# EAGLE design tinyha_power (EAGLE 7.5.0)
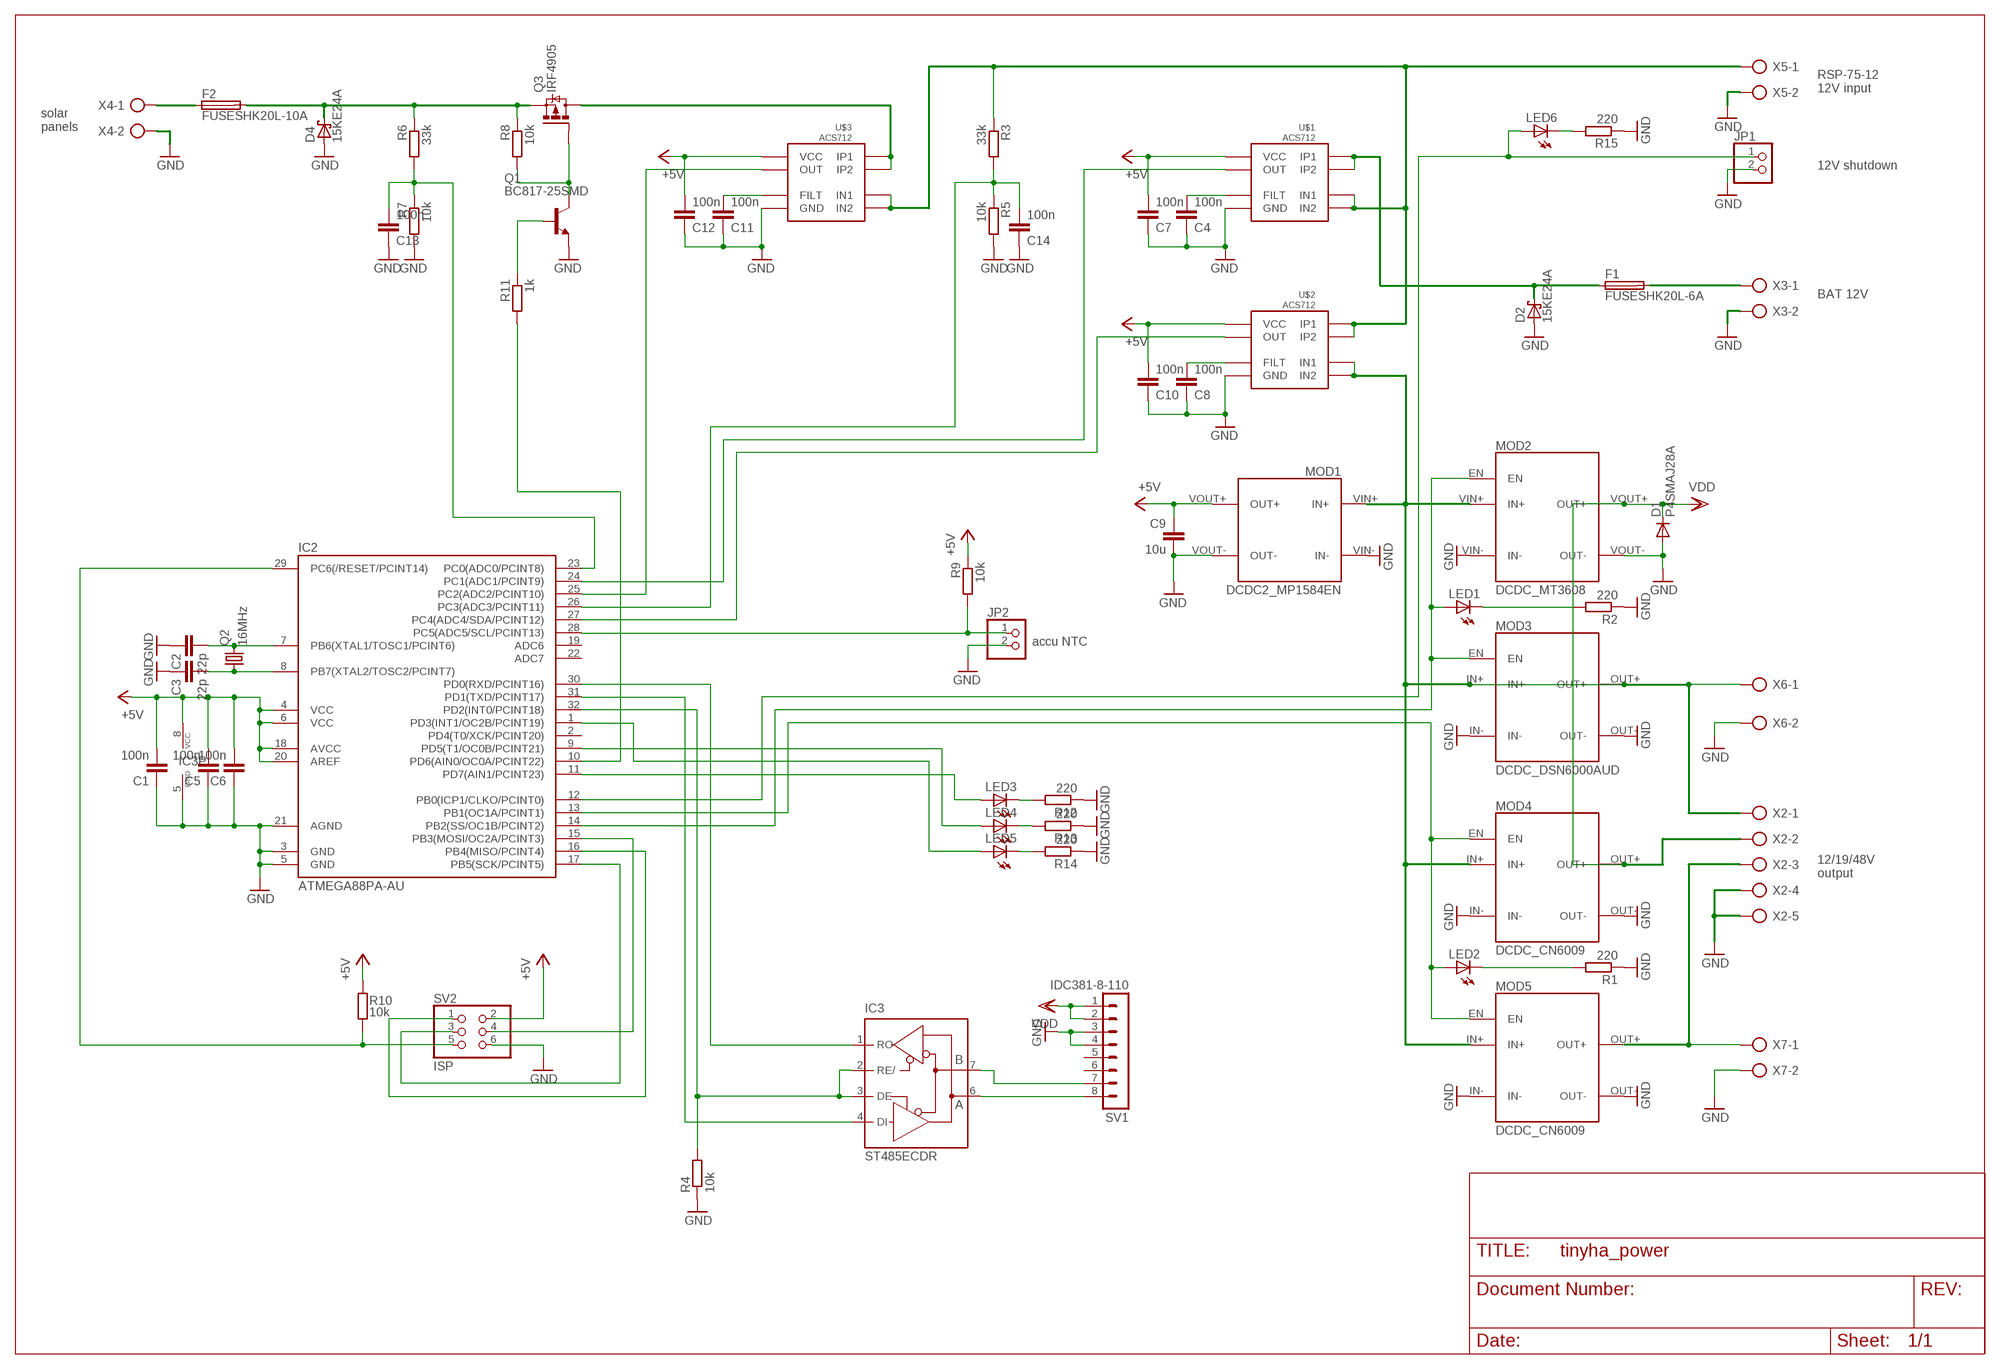
[diagram p0: schematic, sheet 1]

## Parts
C1  100n  C-EUC0805K  [C0805K]
C2  22p  C-EUC0805K  [C0805K]
C3  22p  C-EUC0805K  [C0805K]
C4  100n  C-EUC0805  [C0805]
C5  100n  C-EUC0805K  [C0805K]
C6  100n  C-EUC0805K  [C0805K]
C7  100n  C-EUC0805  [C0805]
C8  100n  C-EUC0805  [C0805]
C9  10u  C-EUC0805K  [C0805K]
C10  100n  C-EUC0805  [C0805]
C11  100n  C-EUC0805  [C0805]
C12  100n  C-EUC0805  [C0805]
C13  100n  C-EUC0805  [C0805]
C14  100n  C-EUC0805  [C0805]
D1  P4SMAJ28A  DIODE-DO214AC  [DO214AC]
D2  15KE24A  15KEXX  [CB429-17]
D4  15KE24A  15KEXX  [CB429-17]
F1  FUSESHK20L-6A  FUSESHK20L  [SHK20L]
F2  FUSESHK20L-10A  FUSESHK20L  [SHK20L]
IC2  ATMEGA88PA-AU  ATMEGA48/88/168-AU  [TQFP32-08]
IC3  ST485ECDR  MAX481CSA  [SO08]
JP1  PINHD-1X2  [1X02]
JP2  PINHD-1X2  [1X02]
LED1  LED3MM  [LED3MM]
LED2  LED3MM  [LED3MM]
LED3  LED3MM  [LED3MM]
LED4  LED3MM  [LED3MM]
LED5  LED3MM  [LED3MM]
LED6  LED3MM  [LED3MM]
MOD1  DCDC2_MP1584EN  [DCDC_MP1584EN]
MOD2  DCDC_MT3608  [DCDC_MT3608]
MOD3  DCDC_DSN6000AUD  [DCDC_DSN6000AUD]
MOD4  DCDC_CN6009  [DCDC_CN6009]
MOD5  DCDC_CN6009  [DCDC_CN6009]
Q1  BC817-25SMD  [SOT23-BEC]
Q2  16MHz  CRYSTALHC49S  [HC49/S]
Q3  IRF4905  [TO220BH]
R1  220  R-EU_R0805  [R0805]
R2  220  R-EU_R0805  [R0805]
R3  33k  R-EU_R0805  [R0805]
R4  10k  R-EU_R0805  [R0805]
R5  10k  R-EU_R0805  [R0805]
R6  33k  R-EU_R0805  [R0805]
R7  10k  R-EU_R0805  [R0805]
R8  10k  R-EU_R0805  [R0805]
R9  10k  R-EU_R0805  [R0805]
R10  10k  R-EU_R0805  [R0805]
R11  1k  R-EU_R0805  [R0805]
R12  220  R-EU_R0805  [R0805]
R13  220  R-EU_R0805  [R0805]
R14  220  R-EU_R0805  [R0805]
R15  220  R-EU_R0805  [R0805]
SV1  IDC381-8-110  MA08-1-IDC  [IDC381-8]
SV2  ISP  PINHD-2X3/H  [2X03/H]
U$1  ACS712  [SO8]
U$2  ACS712  [SO8]
U$3  ACS712  [SO8]
X2  AK500/5  [AK500/5]
X3  AK500/2  [AK500/2]
X4  AK500/2  [AK500/2]
X5  AK500/2  [AK500/2]
X6  AK500/2  [AK500/2]
X7  AK500/2  [AK500/2]

## Nets
+5V: C1.2 C5.2 C6.2 C7.2 C9.1 C10.2 C12.2 IC2.4(VCC) IC2.6(VCC) IC2.18(AVCC) IC2.20(AREF) IC3.8(VCC) MOD1.VOUT+(OUT+) R9.1 R10.1 SV2.2 U$1.8(VCC) U$2.8(VCC) U$3.8(VCC)
DIR: IC2.32(PD2(INT0/PCINT18)) IC3.2(RE/) IC3.3(DE) R4.2
GND: C1.1 C2.1 C3.1 C4.1 C5.1 C6.1 C7.1 C8.1 C9.2 C10.1 C11.1 C12.1 C13.1 C14.1 D1.A D2.A D4.A IC2.3(GND) IC2.5(GND) IC2.21(AGND) IC3.5(GND) JP1.2 JP2.2 MOD1.VIN-(IN-) MOD1.VOUT-(OUT-) MOD2.VIN-(IN-) MOD2.VOUT-(OUT-) MOD3.IN- MOD3.OUT- MOD4.IN- MOD4.OUT- MOD5.IN- MOD5.OUT- Q1.E R1.1 R2.1 R4.1 R5.2 R7.2 R12.1 R13.1 R14.1 R15.1 SV1.3 SV1.4 SV2.6 U$1.5(GND) U$2.5(GND) U$3.5(GND) X2.4 X2.5 X3.2 X4.2 X5.2 X6.2 X7.2
MOSI: IC2.15(PB3(MOSI/OC2A/PCINT3)) SV2.4
N$1: D4.C F2.2A Q3.S R6.1 R8.1
N$2: IC2.13(PB1(OC1A/PCINT1)) LED2.A MOD4.EN MOD5.EN
N$3: IC2.14(PB2(SS/OC1B/PCINT2)) LED1.A MOD2.EN MOD3.EN
N$4: LED2.K(C) R1.2
N$5: LED1.K(C) R2.2
N$6: IC2.11(PD7(AIN1/PCINT23)) LED3.A
N$7: C4.2 U$1.6(FILT)
N$8: D2.C F1.1A U$1.1(IP1) U$1.2(IP2)
N$9: IC2.9(PD5(T1/OC0B/PCINT21)) LED4.A
N$10: IC3.7(B) SV1.7
N$11: LED6.K(C) R15.2
N$12: C8.2 U$2.6(FILT)
N$15: IC3.6(A) SV1.8
N$16: MOD5.OUT+ X2.3 X7.1
N$17: F1.2A X3.1
N$18: IC2.1(PD3(INT1/OC2B/PCINT19)) LED5.A
N$19: IC2.28(PC5(ADC5/SCL/PCINT13)) JP2.1 R9.2
N$21: MOD1.VIN+(IN+) MOD2.VIN+(IN+) MOD3.IN+ MOD3.OUT+ MOD4.IN+ MOD5.IN+ U$2.3(IN1) U$2.4(IN2) X2.1 X6.1
N$22: C11.2 U$3.6(FILT)
N$24: C3.2 IC2.8(PB7(XTAL2/TOSC2/PCINT7)) Q2.1
N$25: Q1.C Q3.G R8.2
N$26: C14.2 IC2.26(PC3(ADC3/PCINT11)) R3.2 R5.1
N$27: IC2.24(PC1(ADC1/PCINT9)) U$1.7(OUT)
N$28: IC2.27(PC4(ADC4/SDA/PCINT12)) U$2.7(OUT)
N$29: F2.1A X4.1
N$30: R3.1 U$1.3(IN1) U$1.4(IN2) U$2.1(IP1) U$2.2(IP2) U$3.3(IN1) U$3.4(IN2) X5.1
N$31: C2.2 IC2.7(PB6(XTAL1/TOSC1/PCINT6)) Q2.2
N$32: Q3.D U$3.1(IP1) U$3.2(IP2)
N$33: IC2.25(PC2(ADC2/PCINT10)) U$3.7(OUT)
N$34: C13.2 IC2.23(PC0(ADC0/PCINT8)) R6.2 R7.1
N$35: Q1.B R11.1
N$36: IC2.10(PD6(AIN0/OC0A/PCINT22)) R11.2
N$37: LED3.K(C) R12.2
N$38: LED4.K(C) R13.2
N$39: LED5.K(C) R14.2
N$40: IC2.12(PB0(ICP1/CLKO/PCINT0)) JP1.1 LED6.A
RESET: IC2.29(PC6(/RESET/PCINT14)) R10.2 SV2.5
RXD: IC2.30(PD0(RXD/PCINT16)) IC3.1(RO)
SCK: IC2.17(PB5(SCK/PCINT5)) SV2.3
TXD: IC2.31(PD1(TXD/PCINT17)) IC3.4(DI)
UH: IC2.16(PB4(MISO/PCINT4)) SV2.1
VDD: D1.C MOD2.VOUT+(OUT+) MOD4.OUT+ SV1.1 SV1.2 X2.2
Unconnected: IC2.2(PD4(T0/XCK/PCINT20)) IC2.19(ADC6) IC2.22(ADC7) SV1.5 SV1.6

## Notes on the sheet
- RSP-75-12
  12V input
- solar
  panels
- 12V shutdown
- BAT 12V
- accu NTC
- 12/19/48V
  output

## Library data of the parts
C1-C14 = rcl:C-EU: CAPACITOR, European symbol
D1 = diode:DIODE-: DIODE
D2 D4 = diode:15KEXX: DIODE
F1 F2 = fuse:FUSE: Fuse; OC_FARNELL: unknown; OC_NEWARK: unknown
IC2 = atmega8:ATMEGA48/88/168
IC3 = maxim:MAX481CSA: RS485 TRANSEIVER; MF: MAXIM; MPN: MAX481CSA; OC_FARNELL: unknown; OC_NEWARK: 90C3817
JP1 JP2 = pinhead:PINHD-1X2: PIN HEADER
LED1-LED6 = led:LED: LED OSRAM: - CHIPLED LG R971, LG N971, LY N971, LG Q971, LY Q971, LO R971, LY R971 LH N974, LH R974 LS Q976, LO Q976, LY Q976 LO Q996 - Hyper CHIPLED LW Q18S LB Q993, LB Q99A, LB R99A - SideLED LS A670, LO A670, LY A670, LG A670, LP A670 LB A673, LV A673, LT A673, LW A673 LH A674 LY A675 LS A676, LA A676, LO A676, LY A676, LW A676 LS A679, LY A679, LG A679 - Hyper Micro SIDELED® LS Y876, LA Y876, LO Y876, LY Y876 LT Y87S - SmartLED LW L88C, LW L88S LB L89C, LB L89S, LG L890 LS L89K, LO L89K, LY L89K LS L896, LA L896, LO L896, LY L896 - TOPLED LS T670, LO T670, LY T670, LG T670, LP T670 LSG T670, LSP T670, LSY T670, LOP T670, LYG T670 LG T671, LOG T671, LSG T671 LB T673, LV T673, LT T673, LW T673 LH T674 LS T676, LA T676, LO T676, LY T676, LB T676, LH T676, LSB T676, LW T676 LB T67C, LV T67C, LT T67C, LS T67K, LO T67K, LY T67K, LW E67C LS E67B, LA E67B, LO E67B, LY E67B, LB E67C, LV E67C, LT E67C LW T67C LS T679, LY T679, LG T679 LS T770, LO T770, LY T770, LG T770, LP T770 LB T773, LV T773, LT T773, LW T773 LH T774 LS E675, LA E675, LY E675, LS T675 LS T776, LA T776, LO T776, LY T776, LB T776 LHGB T686 LT T68C, LB T68C - Hyper Mini TOPLED® LB M676 - Mini TOPLED Santana® LG M470 LS M47K, LO M47K, LY M47K Source: http://www.osram.convergy.de LUXEON: - LUMILED® LXK2-PW12-R00, LXK2-PW12-S00, LXK2-PW14-U00, LXK2-PW14-V00 LXK2-PM12-R00, LXK2-PM12-S00, LXK2-PM14-U00 LXK2-PE12-Q00, LXK2-PE12-R00, LXK2-PE12-S00, LXK2-PE14-T00, LXK2-PE14-U00 LXK2-PB12-K00, LXK2-PB12-L00, LXK2-PB12-M00, LXK2-PB14-N00, LXK2-PB14-P00, LXK2-PB14-Q00 LXK2-PR12-L00, LXK2-PR12-M00, LXK2-PR14-Q00, LXK2-PR14-R00 LXK2-PD12-Q00, LXK2-PD12-R00, LXK2-PD12-S00 LXK2-PH12-R00, LXK2-PH12-S00 LXK2-PL12-P00, LXK2-PL12-Q00, LXK2-PL12-R00 Source: www.luxeon.com KINGBRIGHT: KA-3528ASYC Source: www.kingbright.com
MOD1 = custom:DCDC2
MOD2-MOD5 = custom:DCDC
Q1 = transistor-npn:BC817*: NPN Transistor
Q2 = crystal:CRYSTAL: CRYSTAL; OC_FARNELL: 1667008; OC_NEWARK: unknown
Q3 = transistor-power:IRF4905: P-Channel HEXFET® Power MOSFET RDS(on)= 0.02 Ohm, ID = -74A Source: http://www.irf.com/product-info/datasheets/data/irf4905pbf.pdf
R1-R15 = rcl:R-EU_: RESISTOR, European symbol
SV1 = custom:MA08-1: PIN HEADER
SV2 = pinhead:PINHD-2X3: PIN HEADER
U$1-U$3 = allegro:ACS712
X2 = con-ptr500:AK500/5: CONNECTOR; OC_FARNELL: unknown; OC_NEWARK: unknown
X3-X7 = con-ptr500:AK500/2: CONNECTOR; OC_FARNELL: unknown; OC_NEWARK: unknown

## Board
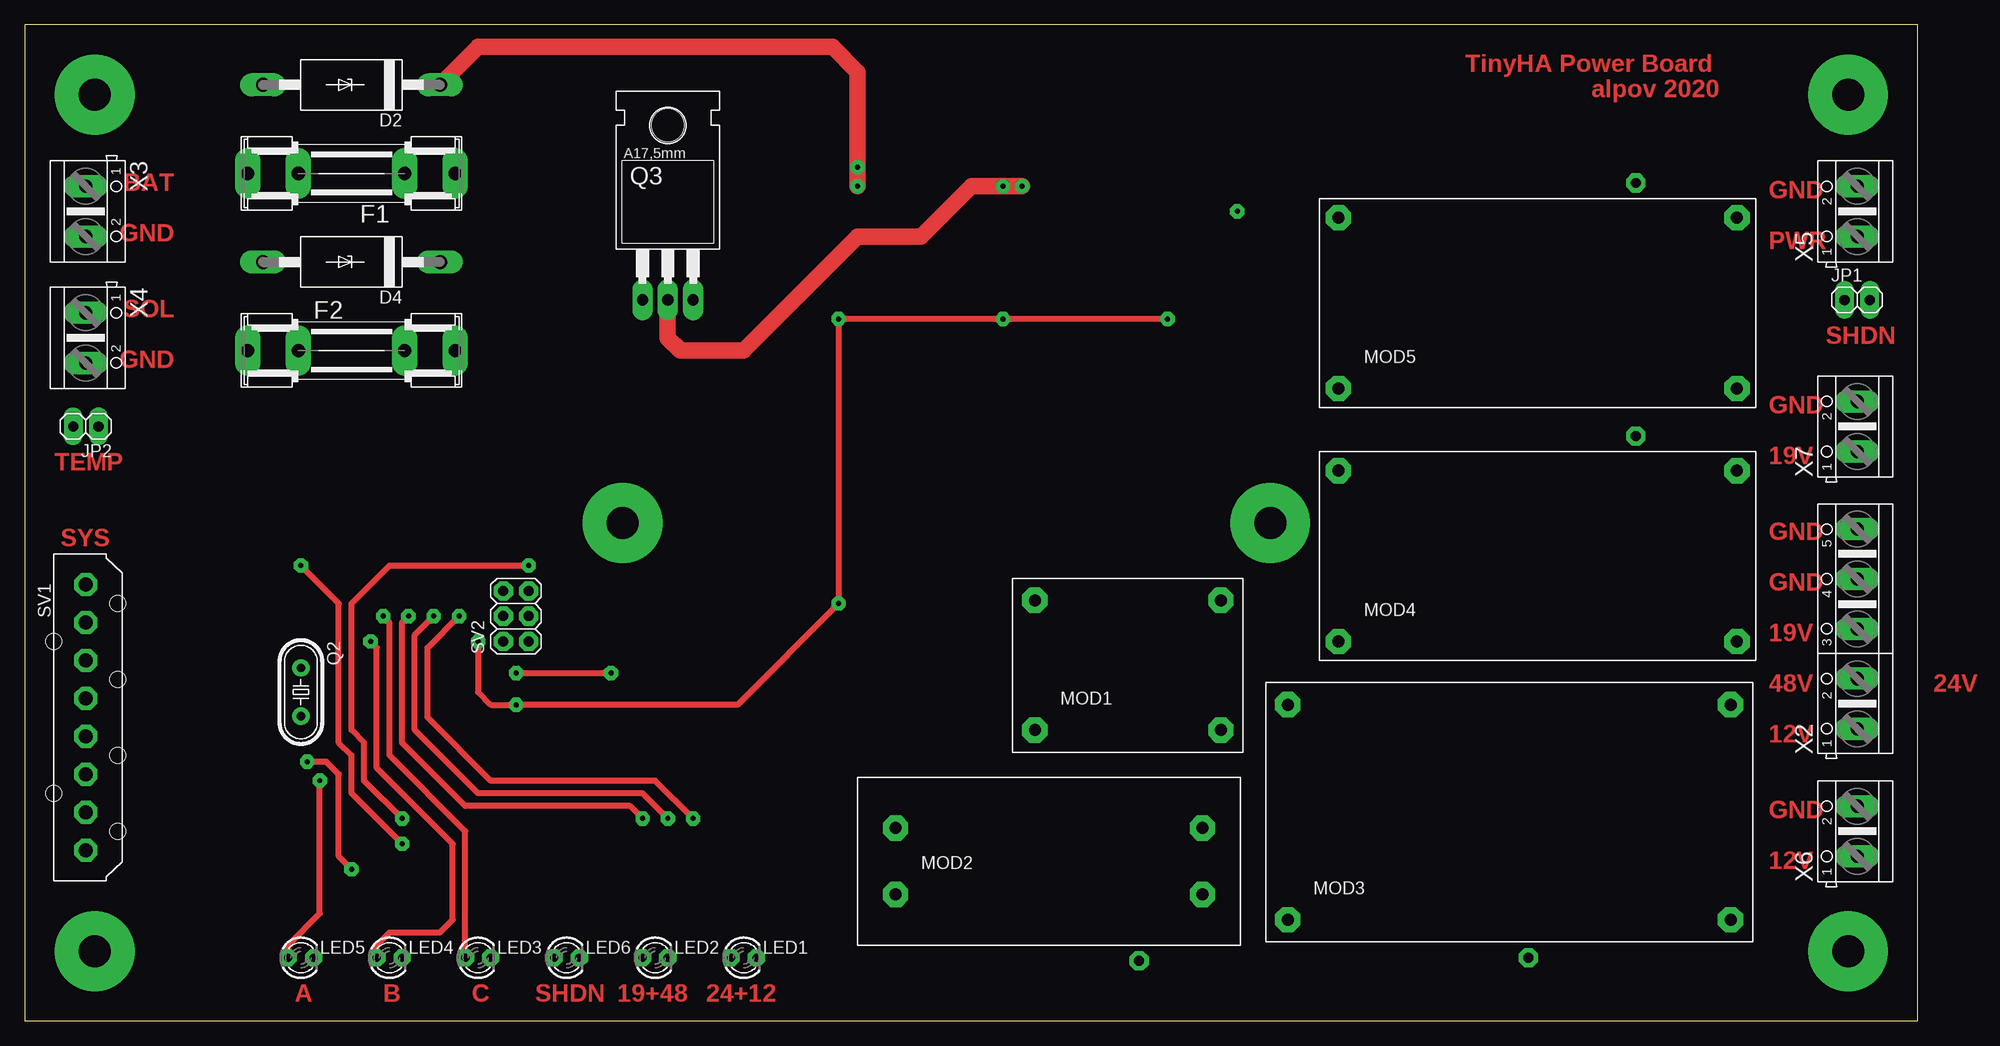
[diagram p1: board, top side]
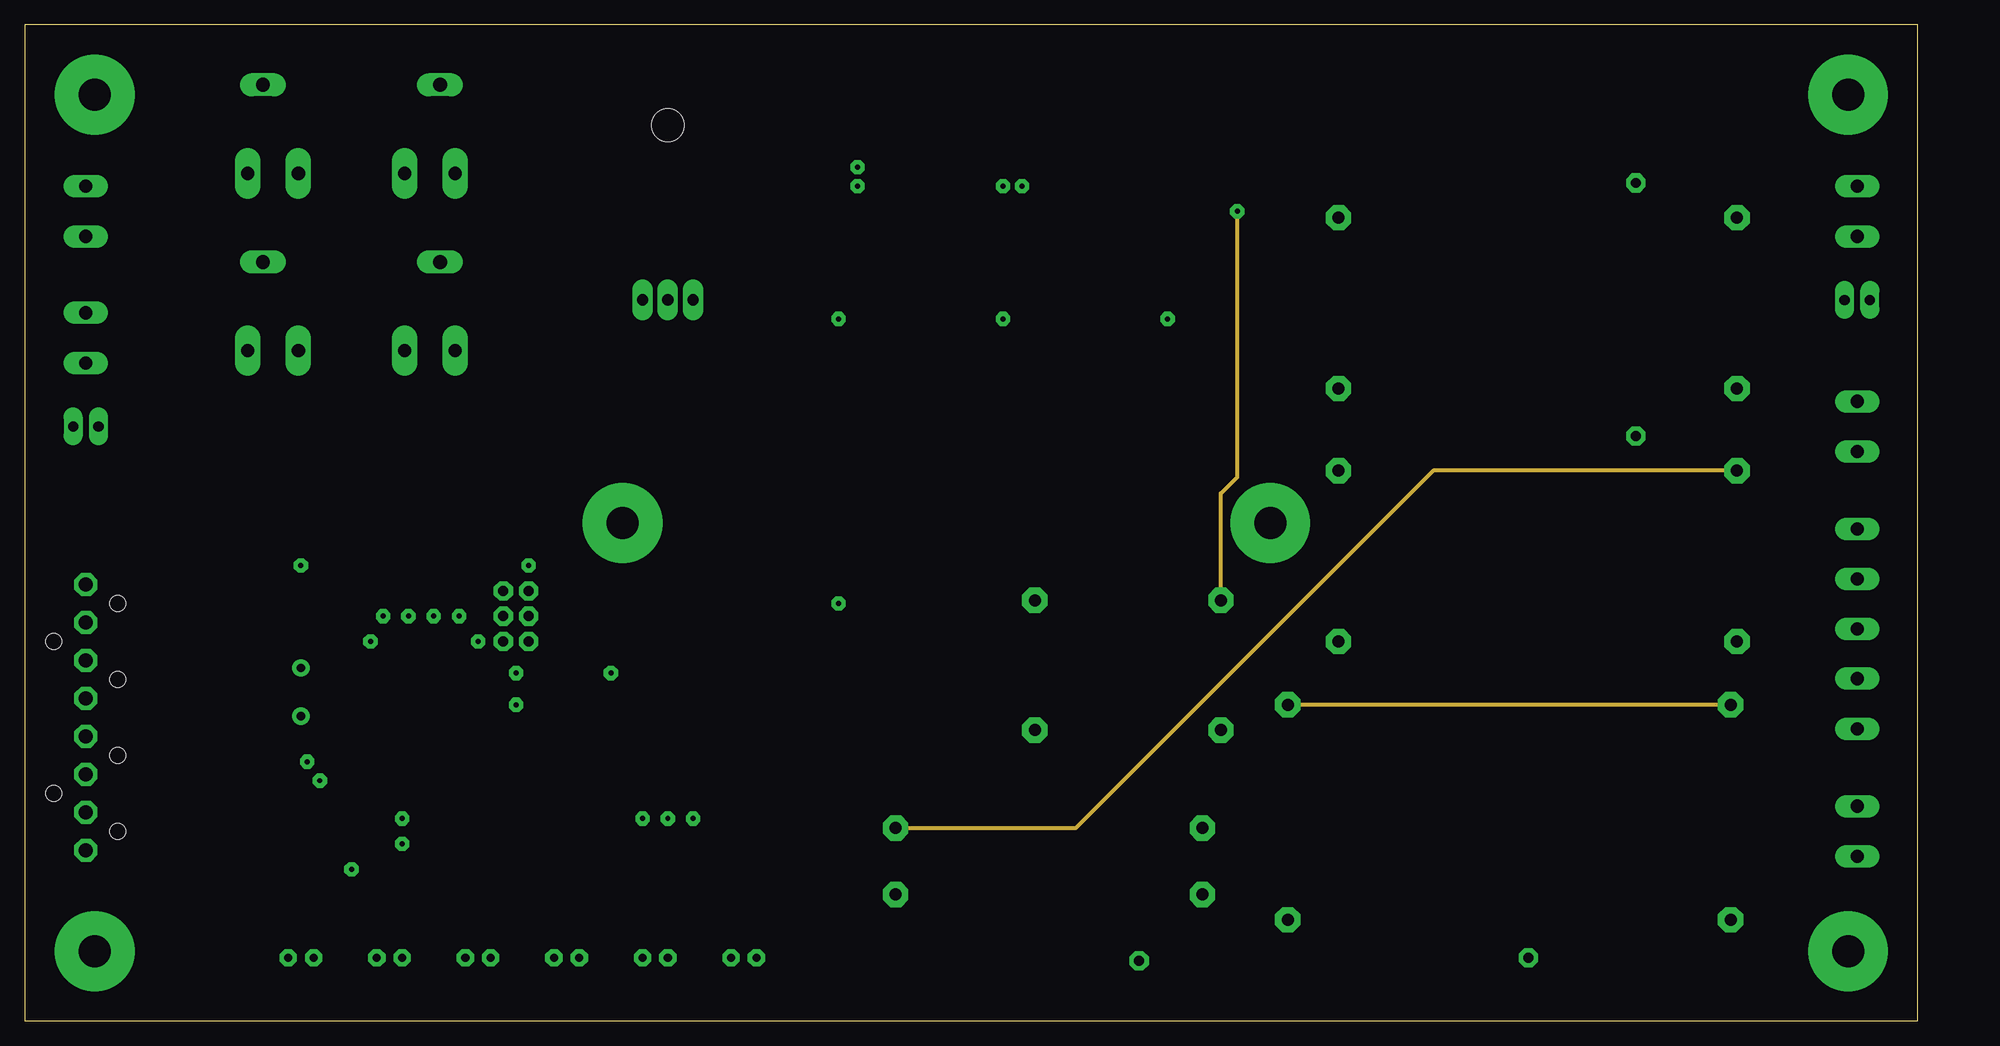
[diagram p2: board, inner layer Route2]
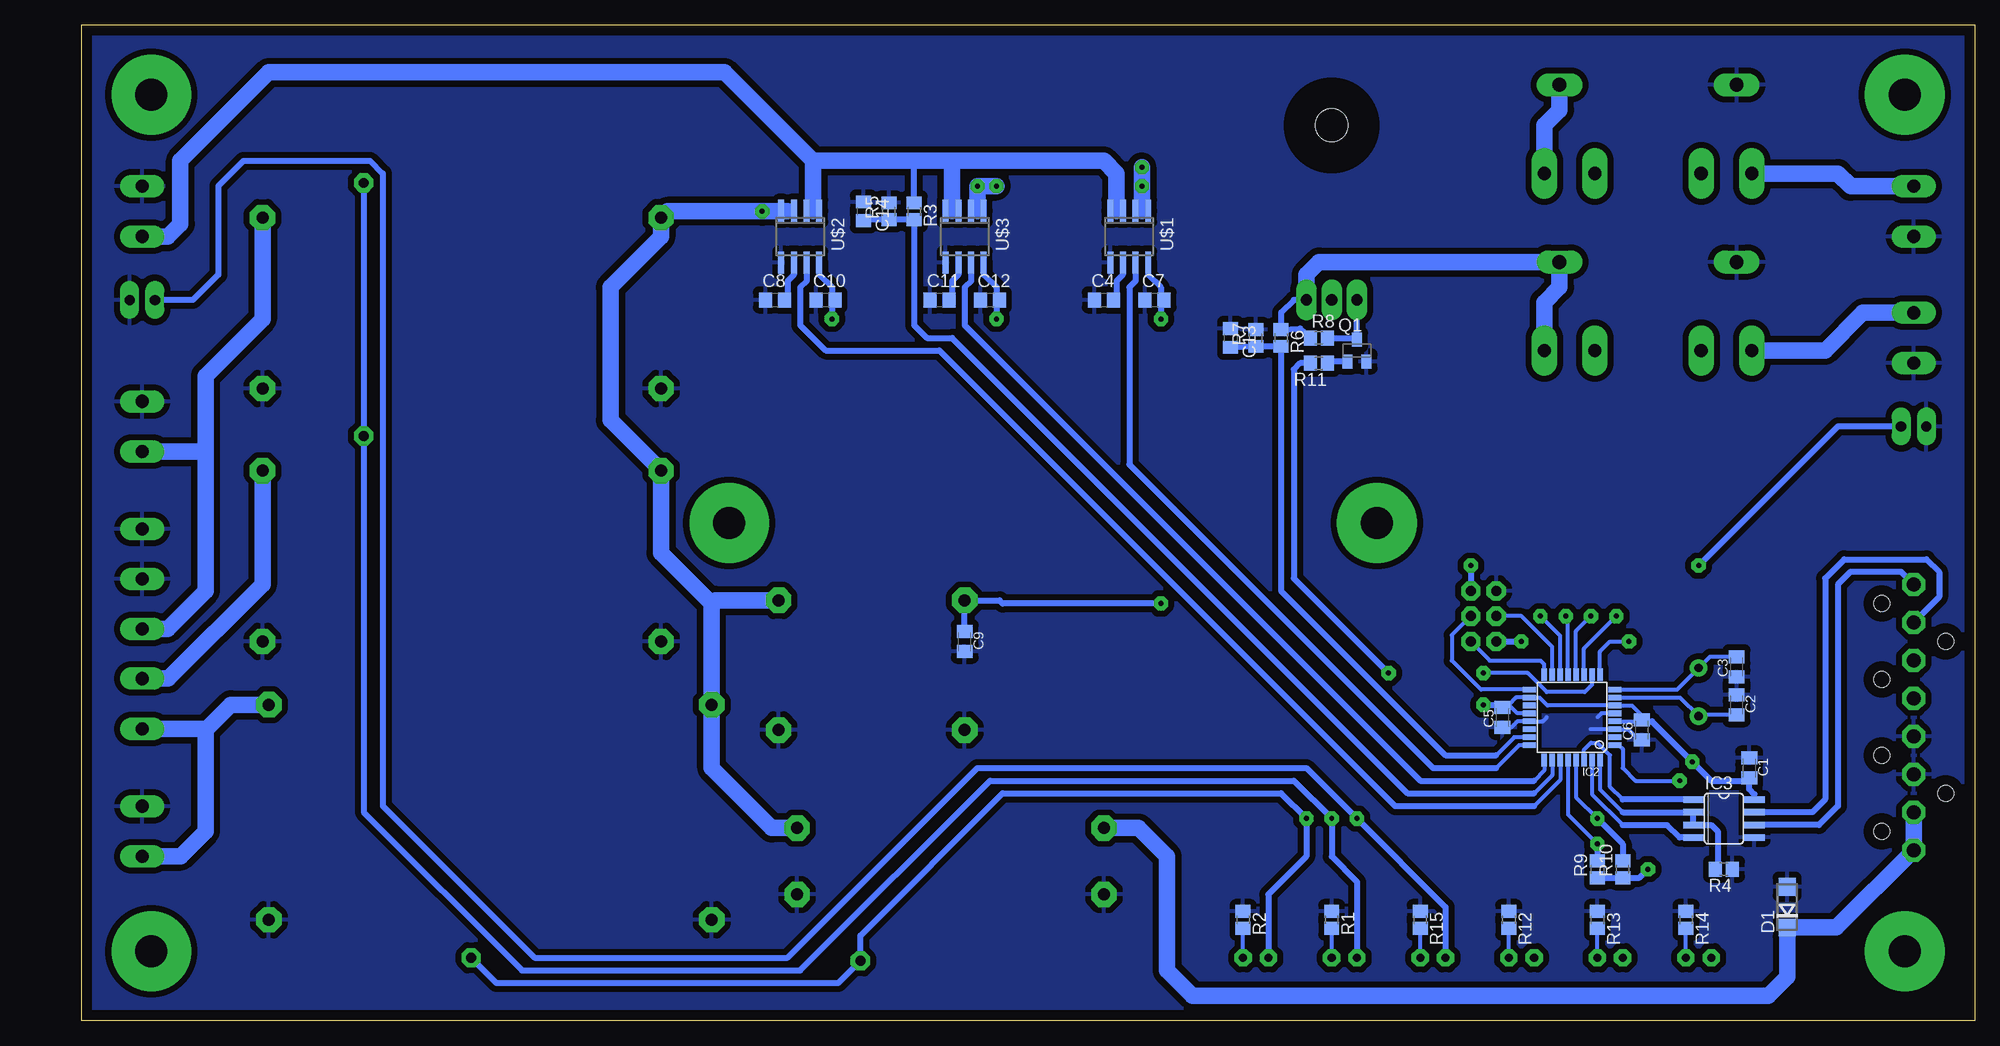
[diagram p3: board, bottom side, seen from below]

Size 190 x 100 mm. Coordinates in mm from the lower left corner, seen from the top.
Outline: 0,0 190,0 190,100 0,100 0,0
Copper layers (1*2*16): Top 0.035mm / dielectric 1.5mm / Route2 0.035mm / dielectric 0.15mm / Bottom 0.035mm
Design rules "default *": minimum track width 10mil, minimum drill 0.5mm, track to track 10mil, track to pad 10mil, pad to pad 8mil, via to via 8mil, smd to smd 8mil, copper to edge 40mil, drill to drill 8mil, minimum pad ring 18mil, minimum via ring 8mil, stop-mask expansion 4mil, vias tented up to drill 0mil, thermal gap 24mil

### Footprints (pad centres in the part's own frame; a part is rotated, then mirrored left to right if it is on the bottom)
C0805K = smd 1.3 x 1.6: 1 -1,0; 2 1,0
C0805 = smd 1.3 x 1.5: 1 -0.95,0; 2 0.95,0
DO214AC = smd 1.8 x 1.7: A 2.05,0; C -2.05,0
CB429-17 = drill 1.397 long: A 8.89,0; C -8.89,0
SHK20L = drill 1.321 pad 2.54 long: 1A -10.414,0; 1B -5.334,0; 2A 10.414,0; 2B 5.334,0
TQFP32-08 = smd 1.27 x 0.559: 1 -4.293,2.8; 2 -4.293,2; 3 -4.293,1.2; 4 -4.293,0.4; 5 -4.293,-0.4; 6 -4.293,-1.2; 7 -4.293,-2; 8 -4.293,-2.8; 17 4.293,-2.8; 18 4.293,-2; 19 4.293,-1.2; 20 4.293,-0.4; 21 4.293,0.4; 22 4.293,1.2; 23 4.293,2; 24 4.293,2.8 | smd 0.559 x 1.27: 9 -2.8,-4.293; 10 -2,-4.293; 11 -1.2,-4.293; 12 -0.4,-4.293; 13 0.4,-4.293; 14 1.2,-4.293; 15 2,-4.293; 16 2.8,-4.293; 25 2.8,4.293; 26 2,4.293; 27 1.2,4.293; 28 0.4,4.293; 29 -0.4,4.293; 30 -1.2,4.293; 31 -2,4.293; 32 -2.8,4.293
SO08 = smd 0.66 x 2.032: 1 -1.905,-3.073; 2 -0.635,-3.073; 3 0.635,-3.073; 4 1.905,-3.073; 5 1.905,3.073; 6 0.635,3.073; 7 -0.635,3.073; 8 -1.905,3.073
1X02 = drill 1.016 long: 1 -1.27,0; 2 1.27,0
LED3MM = drill 0.813 octagon: A -1.27,0; K 1.27,0
DCDC_MP1584EN = drill 1.2 pad 2.54 octagon: VIN+ 18.685,13.018; VIN- 18.685,0; VOUT+ 0,13.018; VOUT- 0,0
DCDC_MT3608 = drill 1 pad 1.93 octagon: EN 24.448,-6.668 | drill 1.2 pad 2.54 octagon: VIN+ 30.797,6.668; VIN- 30.797,0; VOUT+ 0,6.668; VOUT- 0,0
DCDC_DSN6000AUD = drill 1 pad 1.93 octagon: EN 24.13,-3.81 | drill 1.2 pad 2.54 octagon: IN+ 0,21.59; IN- 0,0; OUT+ 44.45,21.59; OUT- 44.45,0
DCDC_CN6009 = drill 1 pad 1.93 octagon: EN 29.845,20.637 | drill 1.2 pad 2.54 octagon: IN+ 0,17.145; IN- 0,0; OUT+ 40.005,17.145; OUT- 40.005,0
SOT23-BEC = smd 1 x 1.4: B -0.95,-1.1; C 0,1.1; E 0.95,-1.1
HC49/S = drill 0.813: 1 -2.413,0; 2 2.413,0
TO220BH = drill 1.118 long: D 0,-6.35; G -2.54,-6.35; S 2.54,-6.35 | hole 3.302: 0,11.176
R0805 = smd 1.3 x 1.5: 1 -0.85,0; 2 0.85,0
IDC381-8 = drill 1.4 pad 2.184 octagon: 1 -13.335,0; 2 -9.525,0; 3 -5.715,0; 4 -1.905,0; 5 1.905,0; 6 5.715,0; 7 9.525,0; 8 13.335,0 | hole 1.6: -11.43,-3.2; -3.81,-3.2; 3.81,-3.2; 11.43,-3.2; -7.62,3.2; 7.62,3.2
2X03/H = drill 1 pad 1.6 octagon: 1 -2.54,-1.27; 2 -2.54,1.27; 3 0,-1.27; 4 0,1.27; 5 2.54,-1.27; 6 2.54,1.27
SO8 = smd 0.6 x 2.2: 1 -1.905,-2.6; 2 -0.635,-2.6; 3 0.635,-2.6; 4 1.905,-2.6; 5 1.905,2.6; 6 0.635,2.6; 7 -0.635,2.6; 8 -1.905,2.6
AK500/5 = drill 1.321 long: 1 -10.033,0; 2 -5.004,0; 3 0,0; 4 5.004,0; 5 10.008,0
AK500/2 = drill 1.321 long: 1 -2.515,0; 2 2.515,0

### Placement (x,y rotation side)
C1  22.62,25.4 270 bottom
C2  23.89,31.75 270 bottom
C3  23.89,35.56 90 bottom
C4  87.39,72.39 0 bottom
C5  47.38,30.48 90 bottom
C6  33.41,29.21 90 bottom
C7  82.31,72.39 0 bottom
C8  120.41,72.39 0 bottom
C9  101.36,38.1 270 bottom
C10  115.33,72.39 0 bottom
C11  103.9,72.39 0 bottom
C12  98.82,72.39 0 bottom
C13  74.69,68.58 270 bottom
C14  111.52,81.28 270 bottom
D1  18.81,11.43 90 bottom
D2  32.78,93.98 180 top
D4  32.78,76.2 180 top
F1  32.78,85.09 180 top
F2  32.78,67.31 0 top
IC2  40.4,30.48 180 bottom
IC3  25.16,20.32 270 bottom
JP1  183.91,72.39 0 top
JP2  6.11,59.69 180 top
LED1  72.15,6.35 0 top
LED2  63.26,6.35 0 top
LED3  45.48,6.35 0 top
LED4  36.59,6.35 0 top
LED5  27.7,6.35 0 top
LED6  54.37,6.35 0 top
MOD1  101.36,29.21 0 top
MOD2  87.39,12.7 0 top
MOD3  126.76,10.16 0 top
MOD4  131.84,38.1 0 top
MOD5  131.84,63.5 0 top
Q1  61.99,67.31 0 bottom
Q2  27.7,33.02 270 top
Q3  64.53,78.74 0 top
R1  64.53,10.16 270 bottom
R2  73.42,10.16 270 bottom
R3  106.44,81.28 270 bottom
R4  25.16,15.24 180 bottom
R5  108.98,81.28 90 bottom
R6  69.61,68.58 270 bottom
R7  72.15,68.58 90 bottom
R8  65.8,68.58 0 bottom
R9  37.86,15.24 90 bottom
R10  35.32,15.24 90 bottom
R11  65.8,66.04 180 bottom
R12  46.75,10.16 270 bottom
R13  37.86,10.16 270 bottom
R14  28.97,10.16 270 bottom
R15  55.64,10.16 270 bottom
SV1  6.11,30.48 90 top
SV2  49.29,40.64 90 top
U$1  84.85,78.74 180 bottom
U$2  117.87,78.74 180 bottom
U$3  101.36,78.74 180 bottom
X2  183.91,39.37 90 top
X3  6.11,81.28 270 top
X4  6.11,68.58 270 top
X5  183.91,81.28 90 top
X6  183.91,19.05 90 top
X7  183.91,59.69 90 top

### Tracks (layer width: path | path; a pad name or v marks a point on that pad's centre or on a via)
+5V  (via drill 0.5 pad 1.42)
  Top 0.61: v114.69,70.48 v98.19,70.48 v81.67,70.48 v81.67,41.91 71.52,31.75 v49.29,31.75 46.75,31.75 45.48,33.02 v45.48,38.1 | v32.78,15.24 31.51,16.51 31.51,24.77 30.24,26.04 v28.34,26.04
  Bottom 0.406: IC2.4 33.55,30.08 C6.2 | 46.75,31.75 46.02,32.48 IC2.18 43.67,32.48 42.87,31.68 IC2.6 34.38,31.68 32.78,30.08 | 46.75,31.75 47.02,31.48 C5.2 | IC2.20 45.88,30.88 46.75,31.75
  Bottom 0.61: IC3.8 22.09,22.76 22.62,23.29 22.62,24.13 | U$2.8 115.97,74.93 114.69,73.66 114.69,72.7 C10.2 114.69,72.39 v114.69,70.48 | U$3.8 99.45,74.93 98.19,73.66 98.19,72.7 C12.2 98.19,72.39 v98.19,70.48 | U$1.8 82.94,74.93 81.67,73.66 81.67,72.7 C7.2 81.67,72.39 v81.67,70.48 | C9.1 MOD1.VOUT+ 97.87,42.23 97.55,41.91 v81.67,41.91 | 33.55,30.08 32.78,30.08 32.38,30.08 v28.34,26.04 26.43,24.13 22.62,24.13 | 22.62,24.13 C1.2 | v49.29,31.75 47.66,31.75 C5.2 | SV2.2 v45.48,38.1 | R9.1 R10.1 33.63,14.39 v32.78,15.24
DIR
  Bottom 0.406: IC2.32 37.6,23.23 35.32,20.95
  Bottom 0.61: R4.2 25.8,15.46 25.8,19.05 26.43,19.68 IC3.3 IC3.2 35.32,20.95
GND
  Bottom 0.406: C6.1 33.69,28.21 34.75,29.28 IC2.3 38.56,29.28 | C5.1 46.48,29.48 45.88,30.08 IC2.21 43.34,30.08 42.94,30.48 | IC2.5 37.46,30.88 37.86,30.48
  pour Bottom (isolate 0.61): -0.24,0 190.26,0 190.26,100.33 -0.24,100.33
MOSI
  Bottom 0.406: IC2.15 42.4,37.56 45.48,40.64 SV2.4
N$1
  Bottom 0.61: Q3.S 68.34,72.39 69.61,71.12 R6.1 67.7,69.53 R8.1
  Bottom 1.676: F2.2A 43.19,72.14 41.67,73.66 D4.C 65.8,76.2 67.07,74.93 Q3.S
N$2  (via drill 0.5 pad 1.42)
  Top 0.61: v64.53,20.32 61.99,22.86 45.48,22.86 39.13,29.21 39.13,38.73 v41.03,40.64
  Bottom 0.406: IC2.13 40.8,40.41 v41.03,40.64
  Bottom 0.61: MOD5.EN MOD4.EN 161.69,20.95 145.81,5.08 117.87,5.08 98.82,24.13 68.34,24.13 v64.53,20.32 64.53,16.51 61.99,13.97 LED2.A
N$3  (via drill 0.5 pad 1.42)
  Top 0.61: v67.07,20.32 63.26,24.13 46.75,24.13 40.4,30.48 40.4,37.47 v43.58,40.64
  Bottom 0.406: IC2.14 41.6,38.66 v43.58,40.64
  Bottom 0.61: 150.57,6.03 MOD3.EN 148.35,3.81 114.06,3.81 MOD2.EN 111.84,8.57 97.55,22.86 69.61,22.86 v67.07,20.32 67.07,16.51 70.88,12.7 LED1.A
N$4
  Bottom 0.406: LED2.K R1.2
N$5
  Bottom 0.406: LED1.K R2.2
N$6  (via drill 0.5 pad 1.42)
  Top 0.61: LED3.A 44.21,19.05 36.59,26.67 36.59,40.01 v35.95,40.64
  Bottom 0.406: IC2.11 39.2,37.4 v35.95,40.64
N$7
  Bottom 0.61: U$1.6 85.48,74.93 86.12,74.3 86.12,72.71 C4.2
N$8  (via drill 0.5 pad 1.42)
  Top 1.676: v83.58,83.82 v83.58,85.72 83.58,95.25 81.04,97.79 45.48,97.79 D2.C
  Bottom 0.61: U$1.1 83,81.28 83.58,81.28 84.16,81.28 U$1.2
  Bottom 1.676: F1.1A 43.19,89.92 41.67,91.44 D2.C | v83.58,85.72 v83.58,83.82 83.58,81.28
N$9  (via drill 0.5 pad 1.42)
  Top 0.61: LED4.A 35.32,7.62 36.59,8.89 41.67,8.89 42.94,10.16 42.94,17.78 35.32,25.4 35.32,37.47 v34.69,38.1
  Bottom 0.406: IC2.9 37.6,37.09 36.59,38.1 v34.69,38.1
N$10
  Bottom 0.61: SV1.7 3.57,42.55 3.57,45.09 4.84,46.35 13.1,46.35 15,44.45 15,22.23 16.27,20.95 IC3.7
N$11
  Bottom 0.406: LED6.K R15.2
N$12
  Bottom 0.61: U$2.6 118.5,74.93 119.14,74.3 119.14,72.71 C8.2
N$15
  Bottom 0.61: SV1.8 7.38,45.09 12.46,45.09 13.73,43.81 13.73,21.59 15.63,19.68 IC3.6
N$16
  Bottom 1.676: X2.3 181.37,39.37 177.56,43.18 177.56,57.15 | 177.56,57.15 177.56,64.77 171.84,70.48 MOD5.OUT+ | X7.1 177.59,57.17 177.56,57.15
N$17
  Bottom 1.676: X3.1 12.44,83.8 13.73,85.09 F1.2A
N$18  (via drill 0.5 pad 1.42)
  Top 0.61: LED5.A 26.43,7.62 29.61,10.79 v29.61,24.13
  Bottom 0.406: IC2.1 35.7,27.68 35.32,27.3 35.32,25.4 34.05,24.13 v29.61,24.13
N$19  (via drill 0.5 pad 1.42)
  Top 0.61: v37.86,17.78 32.78,22.86 32.78,26.67 31.51,27.94 31.51,41.91 v27.7,45.72
  Bottom 0.406: IC2.28 40.8,20.72 v37.86,17.78
  Bottom 0.61: JP2.1 13.73,59.69 v27.7,45.72 | v37.86,17.78 R9.2
N$20  (via drill 3.2 pad 8)
  other vias: 60,50
N$21  (via drill 0.5 pad 1.42)
  Route2 0.406: MOD3.OUT+ MOD3.IN+ | MOD1.VIN+ 120.05,52.98 121.68,54.61 v121.68,81.28
  Bottom 0.61: U$2.4 119.72,81.28 119.14,81.28 118.56,81.28 U$2.3
  Bottom 1.676: MOD2.VIN+ 120.73,19.37 126.76,25.4 MOD3.IN+ 126.76,41.91 131.84,46.99 MOD4.IN+ 136.92,60.33 136.92,73.66 131.84,78.74 MOD5.IN+ 131.2,81.28 v121.68,81.28 119.14,81.28 | X2.1 177.69,29.34 177.56,29.21 | 177.56,29.21 175.02,31.75 MOD3.OUT+ | X6.1 180.07,16.54 177.56,19.05 177.56,29.21 | 126.44,42.23 MOD1.VIN+
N$22
  Bottom 0.61: U$3.6 102,74.93 102.63,74.3 102.63,72.71 C11.2
N$24
  Bottom 0.406: C3.2 26.57,36.56 Q2.1 29.85,33.28 IC2.8
N$25
  Bottom 0.61: Q3.G Q1.C 62.16,68.58 R8.2
N$26
  Bottom 0.406: IC2.26 42.4,24.67 44.21,22.86
  Bottom 0.61: C14.2 111.42,80.43 R5.1 R3.2 106.44,69.85 105.17,68.58 102.63,68.58 56.91,22.86 44.21,22.86
N$27
  Bottom 0.406: 48.02,25.4 45.74,27.68 IC2.24
  Bottom 0.61: U$1.7 84.22,74.3 84.85,73.66 84.85,55.88 54.37,25.4 48.02,25.4
N$28
  Bottom 0.406: IC2.27 41.6,24.2 44.21,21.59
  Bottom 0.61: U$2.7 117.23,74.3 117.87,73.66 117.87,69.85 115.33,67.31 103.9,67.31 58.18,21.59 44.21,21.59
N$29
  Bottom 1.676: X4.1 11.21,71.09 15,67.31 F2.1A
N$30
  Bottom 0.61: U$2.2 117.17,81.28 116.6,81.28 116.03,81.28 U$2.1 | U$3.3 102.06,81.28 102.63,81.28 103.2,81.28 U$3.4 | R3.1 106.44,86.36 | U$1.4 86.18,81.34 86.12,81.28 85.55,81.28 U$1.3
  Bottom 1.676: X5.1 182.66,78.77 182.64,78.74 181.37,78.74 180.1,80.01 180.1,86.36 171.21,95.25 125.49,95.25 116.6,86.36 | 116.6,86.36 106.44,86.36 102.63,86.36 | 102.63,86.36 87.39,86.36 86.12,85.09 86.12,81.28 | 116.6,86.36 116.6,81.28 | 102.63,81.28 102.63,86.36
N$31
  Bottom 0.406: IC2.7 29.57,32.48 Q2.2 27.56,30.75 C2.2
N$32  (via drill 0.5 pad 1.42)
  Top 1.676: v100.09,83.82 v98.19,83.82 95.01,83.82 89.93,78.74 83.58,78.74 72.15,67.31 65.8,67.31 64.53,68.58 Q3.D
  Bottom 0.61: U$3.1 99.52,81.28 100.09,81.28 100.67,81.28 U$3.2
  Bottom 1.676: v98.19,83.82 v100.09,83.82 100.09,81.28
N$33
  Bottom 0.406: IC2.25 43.2,25.14 44.21,24.13
  Bottom 0.61: U$3.7 100.72,74.3 101.36,73.66 101.36,69.85 55.64,24.13 44.21,24.13
N$34
  Bottom 0.406: IC2.23 46.21,28.48 48.02,26.67
  Bottom 0.61: C13.2 R7.1 R6.2 69.61,43.18 53.1,26.67 48.02,26.67
N$35
  Bottom 0.61: Q1.B 64.68,66.21 R11.1
N$36  (via drill 0.5 pad 1.42)
  Top 0.61: v49.29,34.92 v58.81,34.92
  Bottom 0.406: IC2.10 38.4,33.75 39.13,33.02 42.94,33.02 44.84,34.92 v49.29,34.92
  Bottom 0.61: R11.2 67.7,66.04 68.34,65.41 68.34,44.45 v58.81,34.92
N$37
  Bottom 0.406: LED3.K R12.2
N$38
  Bottom 0.406: LED4.K R13.2
N$39
  Bottom 0.406: LED5.K R14.2
N$40  (via drill 0.5 pad 1.42)
  Top 0.61: v61.99,20.32 60.72,21.59 44.21,21.59 37.86,27.94 37.86,40.01 v38.5,40.64
  Bottom 0.406: IC2.12 40,39.13 v38.5,40.64
  Bottom 0.61: JP1.1 178.83,72.39 176.29,74.93 176.29,83.82 173.75,86.36 161.05,86.36 159.78,85.09 159.78,21.59 144.54,6.35 119.14,6.35 100.09,25.4 67.07,25.4 v61.99,20.32 53.1,11.43 LED6.A
N$42  (via drill 3.2 pad 8)
  other vias: 125,50
N$43  (via drill 3.2 pad 8)
  other vias: 7,7
N$44  (via drill 3.2 pad 8)
  other vias: 7,93
N$45  (via drill 3.2 pad 8)
  other vias: 183,93
N$46  (via drill 3.2 pad 8)
  other vias: 183,7
RESET  (via drill 0.5 pad 1.42)
  Top 0.61: v37.86,20.32 34.05,24.13 34.05,27.94 32.78,29.21 32.78,41.91 36.59,45.72 v50.56,45.72
  Bottom 0.406: IC2.29 40,22.46 v37.86,20.32
  Bottom 0.61: v37.86,20.32 35.32,17.78 R10.2 | v50.56,45.72 SV2.5
RXD
  Bottom 0.406: 35.32,22.23 36.59,23.5 36.59,26.67 37.86,27.94 38.5,27.94 39.2,27.23 IC2.30
  Bottom 0.61: IC3.1 35.32,22.23
SCK
  Bottom 0.406: SV2.3 52.47,38.73 52.47,36.2 49.55,33.28 IC2.17
TXD
  Bottom 0.406: IC2.31 38.4,22.77 35.32,19.68
  Bottom 0.61: 35.32,19.68 30.88,19.68 29.61,18.41 IC3.4
UH
  Bottom 0.406: SV2.1 48.66,36.2 43.58,36.2 43.2,35.82 IC2.16
VDD
  Route2 0.406: MOD2.VOUT+ 105.49,19.37 141.37,55.24 MOD4.OUT+
  Bottom 1.676: SV1.2 SV1.1 13.88,9.38 D1.C 18.81,4.45 20.71,2.54 78.5,2.54 81.04,5.08 81.04,16.51 83.9,19.37 MOD2.VOUT+ | X2.2 181.29,34.37 171.84,43.81 MOD4.OUT+

### Text on the board
Top: TinyHA Power Board | alpov 2020 | BAT | GND | GND | PWR | SOL | SHDN | GND | GND | 19V | TEMP | SYS | GND | GND | 19V | 48V | 24V | 12V | GND | 12V | A | B | C | SHDN | 19+48 | 24+12